# Altium schematic sheet DE-020224_01.SchDoc: CuC
size A3; Author: eldar6776@hotmail.com; DrawnBy: Eldar Dedic; Organization: I-MEDIA GROUP d.o.o.; Address1: Osman Topal Paše 18; Address2: 71000 Sarajevo; Address3: Federacija BiH; Address4: Bosna i Hercegovina; DocumentNumber: DE-200216; Revision: 278; SheetNumber: 1; SheetTotal: 2
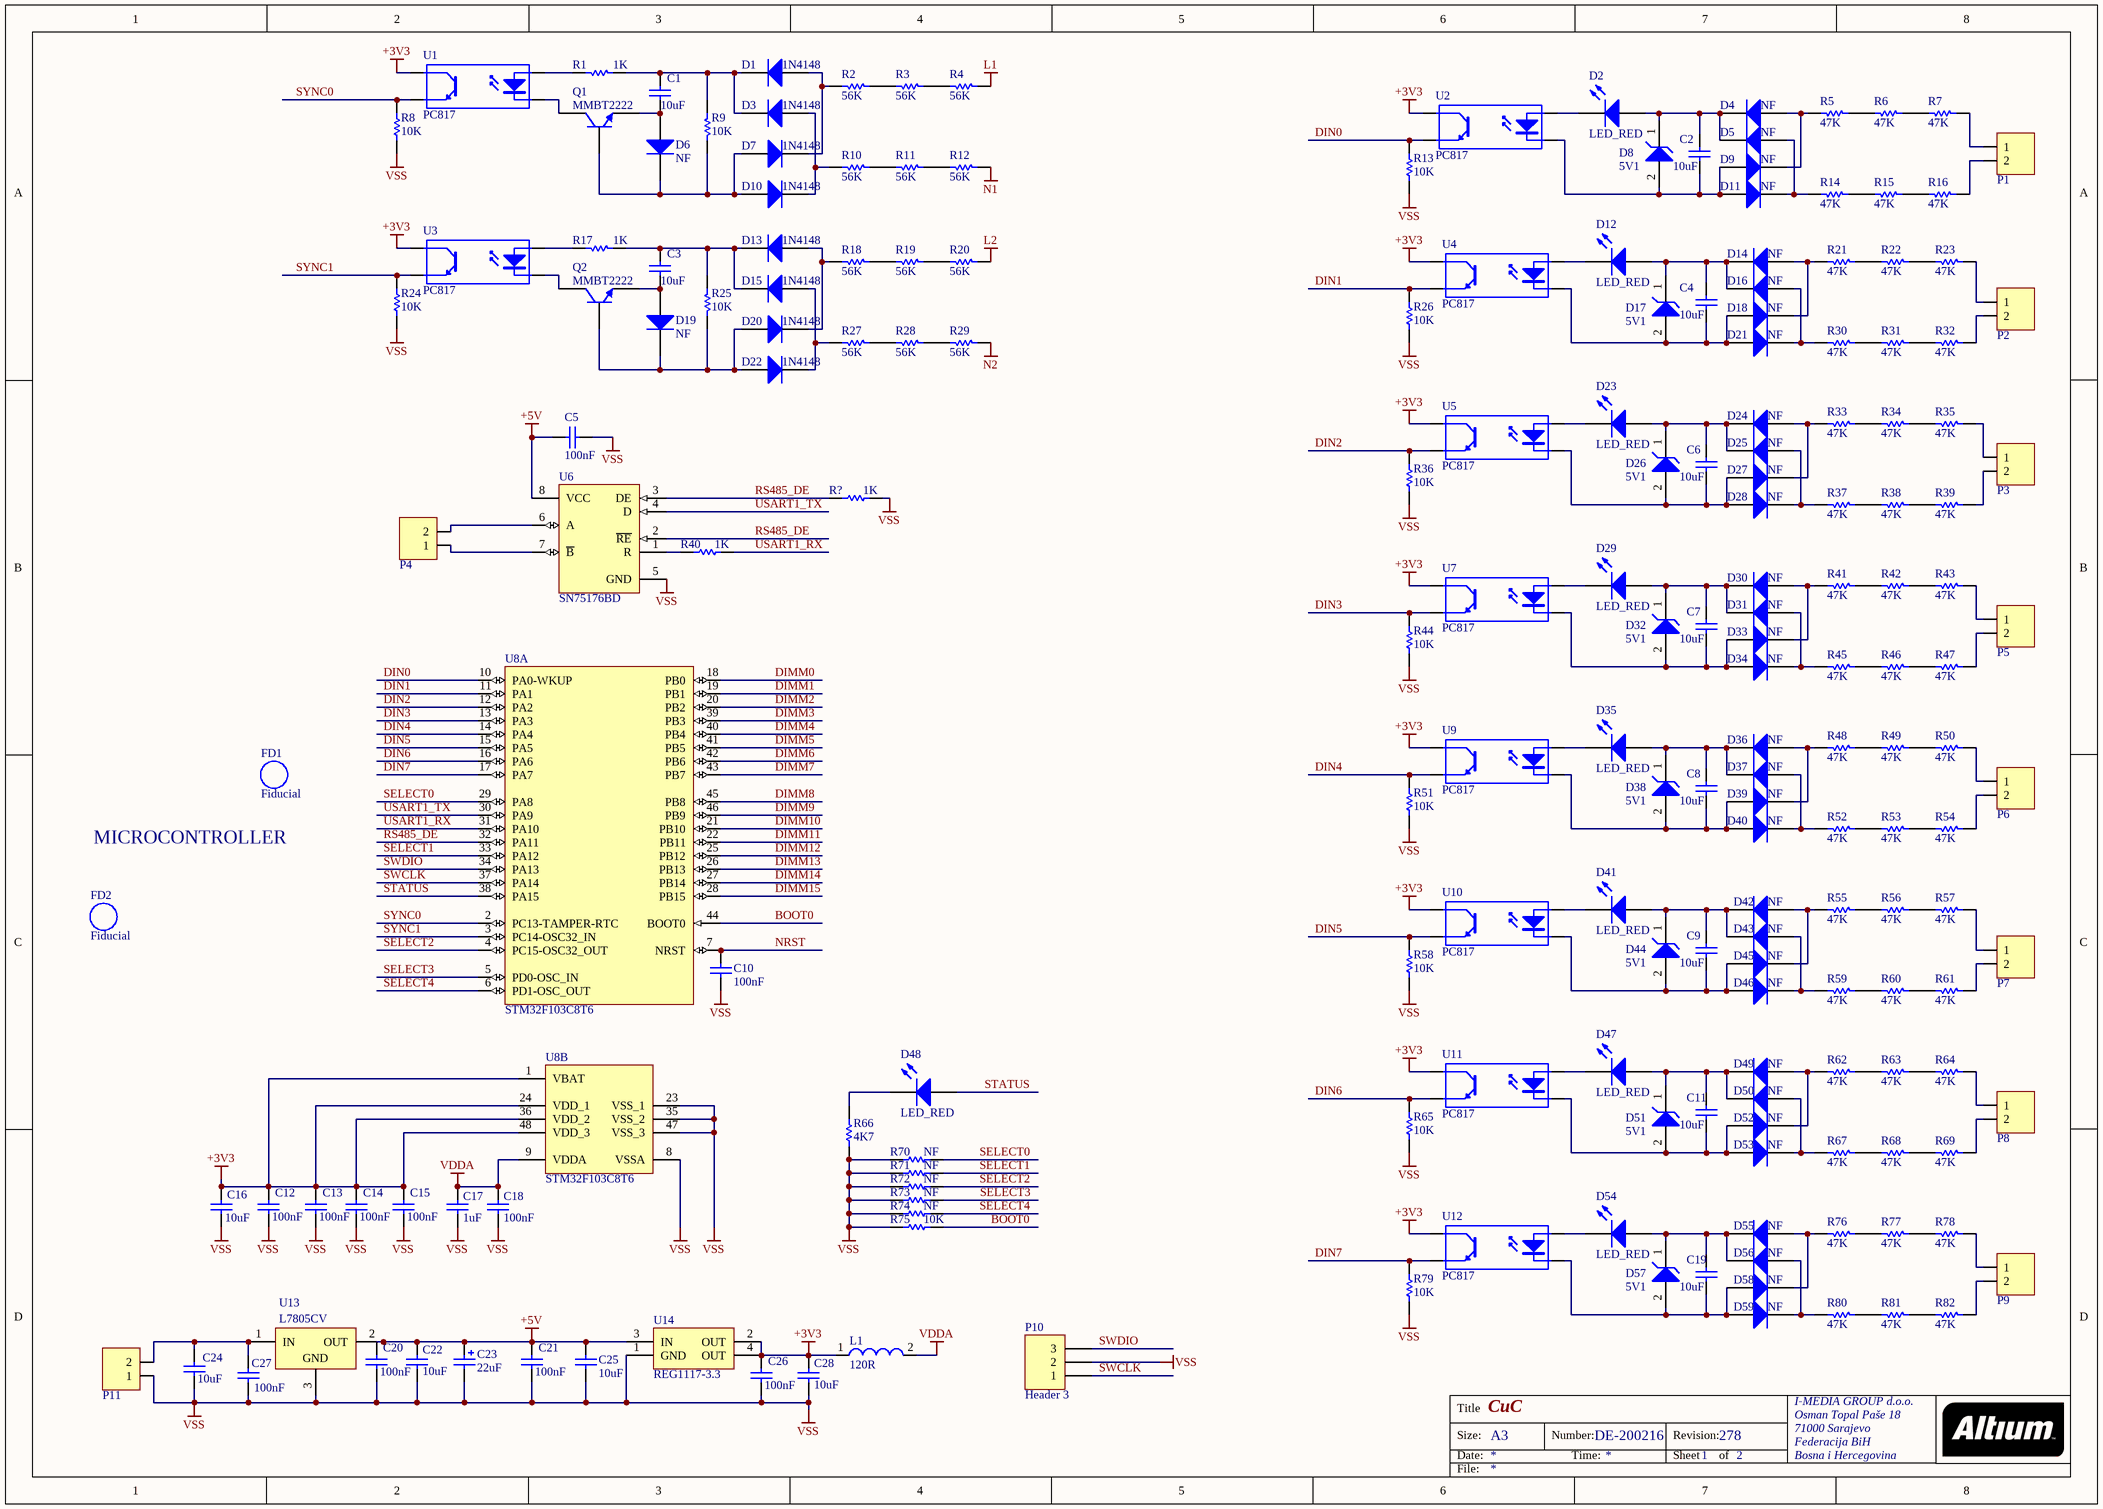
[diagram p0: DE-020224_01.SchDoc]

## Parts
C1  10uF  [0805]
C2  10uF  [0805]
C3  10uF  [0805]
C4  10uF  [0805]
C5  100nF  [0603]
C6  10uF  [0805]
C7  10uF  [0805]
C8  10uF  [0805]
C9  10uF  [0805]
C10  100nF  [0603]
C11  10uF  [0805]
C12  100nF  [0603]
C13  100nF  [0603]
C14  100nF  [0603]
C15  100nF  [0603]
C16  value 10uF  [0805]  (hidden comment: 4u7)
C17  1uF  [0603]
C18  100nF  [0603]
C19  10uF  [0805]
C20  100nF  [0603]
C21  100nF  [0603]
C22  10uF  [0805]
C23  22uF  [CAPPR2-5X11]
C24  10uF  [0805]
C25  10uF  [0805]
C26  100nF  [0603]
C27  100nF  [0603]
C28  10uF  [0805]
D1  1N4148  [SOD323]
D2  LED_RED  [1.6X0.8X0.8]
D3  1N4148  [SOD323]
D4  NF  [SOD323]
D5  NF  [SOD323]
D6  NF  [SOD323]
D7  1N4148  [SOD323]
D8  5V1  [ONSC-SOD-123-2-425-04_V]
D9  NF  [SOD323]
D10  1N4148  [SOD323]
D11  NF  [SOD323]
D12  LED_RED  [1.6X0.8X0.8]
D13  1N4148  [SOD323]
D14  NF  [SOD323]
D15  1N4148  [SOD323]
D16  NF  [SOD323]
D17  5V1  [ONSC-SOD-123-2-425-04_V]
D18  NF  [SOD323]
D19  NF  [SOD323]
D20  1N4148  [SOD323]
D21  NF  [SOD323]
D22  1N4148  [SOD323]
D23  LED_RED  [1.6X0.8X0.8]
D24  NF  [SOD323]
D25  NF  [SOD323]
D26  5V1  [ONSC-SOD-123-2-425-04_V]
D27  NF  [SOD323]
D28  NF  [SOD323]
D29  LED_RED  [1.6X0.8X0.8]
D30  NF  [SOD323]
D31  NF  [SOD323]
D32  5V1  [ONSC-SOD-123-2-425-04_V]
D33  NF  [SOD323]
D34  NF  [SOD323]
D35  LED_RED  [1.6X0.8X0.8]
D36  NF  [SOD323]
D37  NF  [SOD323]
D38  5V1  [ONSC-SOD-123-2-425-04_V]
D39  NF  [SOD323]
D40  NF  [SOD323]
D41  LED_RED  [1.6X0.8X0.8]
D42  NF  [SOD323]
D43  NF  [SOD323]
D44  5V1  [ONSC-SOD-123-2-425-04_V]
D45  NF  [SOD323]
D46  NF  [SOD323]
D47  LED_RED  [1.6X0.8X0.8]
D48  LED_RED  [1.6X0.8X0.8]
D49  NF  [SOD323]
D50  NF  [SOD323]
D51  5V1  [ONSC-SOD-123-2-425-04_V]
D52  NF  [SOD323]
D53  NF  [SOD323]
D54  LED_RED  [1.6X0.8X0.8]
D55  NF  [SOD323]
D56  NF  [SOD323]
D57  5V1  [ONSC-SOD-123-2-425-04_V]
D58  NF  [SOD323]
D59  NF  [SOD323]
FD1  Fiducial  [Fiducial]  (no BOM)
FD2  Fiducial  [Fiducial]  (no BOM)
L1  120R  [SMD-0805]
P1  TERMINAL BLOK 2  [TERMINAL BLOK 2]  (value not drawn)
P2  TERMINAL BLOK 2  [TERMINAL BLOK 2]  (value not drawn)
P3  TERMINAL BLOK 2  [TERMINAL BLOK 2]  (value not drawn)
P4  TERMINAL BLOK 2  [TERMINAL BLOK 2]  (value not drawn)
P5  TERMINAL BLOK 2  [TERMINAL BLOK 2]  (value not drawn)
P6  TERMINAL BLOK 2  [TERMINAL BLOK 2]  (value not drawn)
P7  TERMINAL BLOK 2  [TERMINAL BLOK 2]  (value not drawn)
P8  TERMINAL BLOK 2  [TERMINAL BLOK 2]  (value not drawn)
P9  TERMINAL BLOK 2  [TERMINAL BLOK 2]  (value not drawn)
P10  Header 3  [HDR1X3]
P11  TERMINAL BLOK 2  [TERMINAL BLOK 2]  (value not drawn)
Q1  MMBT2222  [SOT23_N]
Q2  MMBT2222  [SOT23_N]
R1  1K  [ERA-0805]
R2  56K  [ERA-0805]
R3  56K  [ERA-0805]
R4  56K  [ERA-0805]
R5  47K  [ERA-0805]
R6  47K  [ERA-0805]
R7  47K  [ERA-0805]
R8  10K  [ERA-0603]
R9  10K  [ERA-0805]
R10  56K  [ERA-0805]
R11  56K  [ERA-0805]
R12  56K  [ERA-0805]
R13  10K  [ERA-0603]
R14  47K  [ERA-0805]
R15  47K  [ERA-0805]
R16  47K  [ERA-0805]
R17  1K  [ERA-0805]
R18  56K  [ERA-0805]
R19  56K  [ERA-0805]
R20  56K  [ERA-0805]
R21  47K  [ERA-0805]
R22  47K  [ERA-0805]
R23  47K  [ERA-0805]
R24  10K  [ERA-0603]
R25  10K  [ERA-0805]
R26  10K  [ERA-0603]
R27  56K  [ERA-0805]
R28  56K  [ERA-0805]
R29  56K  [ERA-0805]
R30  47K  [ERA-0805]
R31  47K  [ERA-0805]
R32  47K  [ERA-0805]
R33  47K  [ERA-0805]
R34  47K  [ERA-0805]
R35  47K  [ERA-0805]
R36  10K  [ERA-0603]
R37  47K  [ERA-0805]
R38  47K  [ERA-0805]
R39  47K  [ERA-0805]
R40  1K  [ERA-0603]
R41  47K  [ERA-0805]
R42  47K  [ERA-0805]
R43  47K  [ERA-0805]
R44  10K  [ERA-0603]
R45  47K  [ERA-0805]
R46  47K  [ERA-0805]
R47  47K  [ERA-0805]
R48  47K  [ERA-0805]
R49  47K  [ERA-0805]
R50  47K  [ERA-0805]
R51  10K  [ERA-0603]
R52  47K  [ERA-0805]
R53  47K  [ERA-0805]
R54  47K  [ERA-0805]
R55  47K  [ERA-0805]
R56  47K  [ERA-0805]
R57  47K  [ERA-0805]
R58  10K  [ERA-0603]
R59  47K  [ERA-0805]
R60  47K  [ERA-0805]
R61  47K  [ERA-0805]
R62  47K  [ERA-0805]
R63  47K  [ERA-0805]
R64  47K  [ERA-0805]
R65  10K  [ERA-0603]
R66  4K7  [ERA-0603]
R67  47K  [ERA-0805]
R68  47K  [ERA-0805]
R69  47K  [ERA-0805]
R70  NF  [ERA-0603]
R71  NF  [ERA-0603]
R72  NF  [ERA-0603]
R73  NF  [ERA-0603]
R74  NF  [ERA-0603]
R75  10K  [ERA-0603]
R76  47K  [ERA-0805]
R77  47K  [ERA-0805]
R78  47K  [ERA-0805]
R79  10K  [ERA-0603]
R80  47K  [ERA-0805]
R81  47K  [ERA-0805]
R82  47K  [ERA-0805]
R?  1K  [ERA-0603]
U1  PC817  [DIP-4]
U2  PC817  [DIP-4]
U3  PC817  [DIP-4]
U4  PC817  [DIP-4]
U5  PC817  [DIP-4]
U6  SN75176BD  [D008_L]
U7  PC817  [DIP-4]
U8  STM32F103C8T6  [STM-LQFP48_N]  (parts A,B of 2)
U9  PC817  [DIP-4]
U10  PC817  [DIP-4]
U11  PC817  [DIP-4]
U12  PC817  [DIP-4]
U13  L7805CV  [TO220ABN]
U14  REG1117-3.3  [ZZ311]

## Nets
+3V3: C12.2 C13.2 C14.2 C15.2 C16.2 C26.2 C28.2 L1.1 U1.4(C) U2.4(C) U3.4(C) U4.4(C) U5.4(C) U7.4(C) U8.1(VBAT) U8.24(VDD_1) U8.36(VDD_2) U8.48(VDD_3) U9.4(C) U10.4(C) U11.4(C) U12.4(C) U14.2(OUT) U14.4(OUT)
+5V: C5.1 C20.2 C21.2 C22.2 C23.1 C25.2 U6.8(VCC) U13.2(OUT) U14.3(IN)
L1: R4.1
L2: R20.1
N1: R12.1
N2: R29.1
VDDA: C17.2 C18.2 L1.2 U8.9(VDDA)
VSS: C5.2 C10.1 C12.1 C13.1 C14.1 C15.1 C16.1 C17.1 C18.1 C20.1 C21.1 C22.1 C23.2 C24.1 C25.1 C26.1 C27.1 C28.1 P10.2 P11.1 R8.2 R13.2 R24.2 R26.2 R36.2 R44.2 R51.2 R58.2 R65.2 R66.2 R70.2 R71.2 R72.2 R73.2 R74.2 R75.2 R79.2 R?.2 U6.5(GND) U8.8(VSSA) U8.23(VSS_1) U8.35(VSS_2) U8.47(VSS_3) U13.3(GND) U14.1(GND)
BOOT0: R75.1 U8.44(BOOT0)
DIMM0: U8.18(PB0)
DIMM1: U8.19(PB1)
DIMM2: U8.20(PB2)
DIMM3: U8.39(PB3)
DIMM4: U8.40(PB4)
DIMM5: U8.41(PB5)
DIMM6: U8.42(PB6)
DIMM7: U8.43(PB7)
DIMM8: U8.45(PB8)
DIMM9: U8.46(PB9)
DIMM10: U8.21(PB10)
DIMM11: U8.22(PB11)
DIMM12: U8.25(PB12)
DIMM13: U8.26(PB13)
DIMM14: U8.27(PB14)
DIMM15: U8.28(PB15)
DIN0: R13.1 U2.3(E) U8.10(PA0-WKUP)
DIN1: R26.1 U4.3(E) U8.11(PA1)
DIN2: R36.1 U5.3(E) U8.12(PA2)
DIN3: R44.1 U7.3(E) U8.13(PA3)
DIN4: R51.1 U8.14(PA4) U9.3(E)
DIN5: R58.1 U8.15(PA5) U10.3(E)
DIN6: R65.1 U8.16(PA6) U11.3(E)
DIN7: R79.1 U8.17(PA7) U12.3(E)
NRST: C10.2 U8.7(NRST)
RS485_DE: R?.1 U6.2(~{RE}) U6.3(DE) U8.32(PA11)
SELECT0: R70.1 U8.29(PA8)
SELECT1: R71.1 U8.33(PA12)
SELECT2: R72.1 U8.4(PC15-OSC32_OUT)
SELECT3: R73.1 U8.5(PD0-OSC_IN)
SELECT4: R74.1 U8.6(PD1-OSC_OUT)
STATUS: D48.1(A) U8.38(PA15)
SWCLK: P10.1 U8.37(PA14)
SWDIO: P10.3 U8.34(PA13)
SYNC0: R8.1 U1.3(E) U8.2(PC13-TAMPER-RTC)
SYNC1: R24.1 U3.3(E) U8.3(PC14-OSC32_IN)
USART1_RX: R40.2 U8.31(PA10)
USART1_TX: U6.4(D) U8.30(PA9)
NetC1_1: C1.1 D6.2(A) Q1.2(E)
NetC1_2: C1.2 D1.1(K) D3.1(K) R1.2 R9.1
NetC2_1: C2.1 D8.2(A) D9.2(A) D11.2(A) U2.2(K)
NetC2_2: C2.2 D2.1(A) D4.1(K) D5.1(K) D8.1(K)
NetC3_1: C3.1 D19.2(A) Q2.2(E)
NetC3_2: C3.2 D13.1(K) D15.1(K) R17.2 R25.1
NetC4_1: C4.1 D17.2(A) D18.2(A) D21.2(A) U4.2(K)
NetC4_2: C4.2 D12.1(A) D14.1(K) D16.1(K) D17.1(K)
NetC6_1: C6.1 D26.2(A) D27.2(A) D28.2(A) U5.2(K)
NetC6_2: C6.2 D23.1(A) D24.1(K) D25.1(K) D26.1(K)
NetC7_1: C7.1 D32.2(A) D33.2(A) D34.2(A) U7.2(K)
NetC7_2: C7.2 D29.1(A) D30.1(K) D31.1(K) D32.1(K)
NetC8_1: C8.1 D38.2(A) D39.2(A) D40.2(A) U9.2(K)
NetC8_2: C8.2 D35.1(A) D36.1(K) D37.1(K) D38.1(K)
NetC9_1: C9.1 D44.2(A) D45.2(A) D46.2(A) U10.2(K)
NetC9_2: C9.2 D41.1(A) D42.1(K) D43.1(K) D44.1(K)
NetC11_1: C11.1 D51.2(A) D52.2(A) D53.2(A) U11.2(K)
NetC11_2: C11.2 D47.1(A) D49.1(K) D50.1(K) D51.1(K)
NetC19_1: C19.1 D57.2(A) D58.2(A) D59.2(A) U12.2(K)
NetC19_2: C19.2 D54.1(A) D55.1(K) D56.1(K) D57.1(K)
NetC24_2: C24.2 C27.2 P11.2 U13.1(IN)
NetD1_2: D1.2(A) D7.1(K) R2.2
NetD2_2: D2.2(K) U2.1(A)
NetD3_2: D3.2(A) D10.1(K) R10.2
NetD4_2: D4.2(A) D9.1(K) R5.2
NetD5_2: D5.2(A) D11.1(K) R14.2
NetD6_1: D6.1(K) D7.2(A) D10.2(A) Q1.1(B) R9.2
NetD12_2: D12.2(K) U4.1(A)
NetD13_2: D13.2(A) D20.1(K) R18.2
NetD14_2: D14.2(A) D18.1(K) R21.2
NetD15_2: D15.2(A) D22.1(K) R27.2
NetD16_2: D16.2(A) D21.1(K) R30.2
NetD19_1: D19.1(K) D20.2(A) D22.2(A) Q2.1(B) R25.2
NetD23_2: D23.2(K) U5.1(A)
NetD24_2: D24.2(A) D27.1(K) R33.2
NetD25_2: D25.2(A) D28.1(K) R37.2
NetD29_2: D29.2(K) U7.1(A)
NetD30_2: D30.2(A) D33.1(K) R41.2
NetD31_2: D31.2(A) D34.1(K) R45.2
NetD35_2: D35.2(K) U9.1(A)
NetD36_2: D36.2(A) D39.1(K) R48.2
NetD37_2: D37.2(A) D40.1(K) R52.2
NetD41_2: D41.2(K) U10.1(A)
NetD42_2: D42.2(A) D45.1(K) R55.2
NetD43_2: D43.2(A) D46.1(K) R59.2
NetD47_2: D47.2(K) U11.1(A)
NetD48_2: D48.2(K) R66.1
NetD49_2: D49.2(A) D52.1(K) R62.2
NetD50_2: D50.2(A) D53.1(K) R67.2
NetD54_2: D54.2(K) U12.1(A)
NetD55_2: D55.2(A) D58.1(K) R76.2
NetD56_2: D56.2(A) D59.1(K) R80.2
NetP1_1: P1.1 R7.1
NetP1_2: P1.2 R16.1
NetP2_1: P2.1 R23.1
NetP2_2: P2.2 R32.1
NetP3_1: P3.1 R35.1
NetP3_2: P3.2 R39.1
NetP4_1: P4.1 U6.7(~{B})
NetP4_2: P4.2 U6.6(A)
NetP5_1: P5.1 R43.1
NetP5_2: P5.2 R47.1
NetP6_1: P6.1 R50.1
NetP6_2: P6.2 R54.1
NetP7_1: P7.1 R57.1
NetP7_2: P7.2 R61.1
NetP8_1: P8.1 R64.1
NetP8_2: P8.2 R69.1
NetP9_1: P9.1 R78.1
NetP9_2: P9.2 R82.1
NetQ1_3: Q1.3(C) U1.2(K)
NetQ2_3: Q2.3(C) U3.2(K)
NetR1_1: R1.1 U1.1(A)
NetR2_1: R2.1 R3.2
NetR3_1: R3.1 R4.2
NetR5_1: R5.1 R6.2
NetR6_1: R6.1 R7.2
NetR10_1: R10.1 R11.2
NetR11_1: R11.1 R12.2
NetR14_1: R14.1 R15.2
NetR15_1: R15.1 R16.2
NetR17_1: R17.1 U3.1(A)
NetR18_1: R18.1 R19.2
NetR19_1: R19.1 R20.2
NetR21_1: R21.1 R22.2
NetR22_1: R22.1 R23.2
NetR27_1: R27.1 R28.2
NetR28_1: R28.1 R29.2
NetR30_1: R30.1 R31.2
NetR31_1: R31.1 R32.2
NetR33_1: R33.1 R34.2
NetR34_1: R34.1 R35.2
NetR37_1: R37.1 R38.2
NetR38_1: R38.1 R39.2
NetR40_1: R40.1 U6.1(R)
NetR41_1: R41.1 R42.2
NetR42_1: R42.1 R43.2
NetR45_1: R45.1 R46.2
NetR46_1: R46.1 R47.2
NetR48_1: R48.1 R49.2
NetR49_1: R49.1 R50.2
NetR52_1: R52.1 R53.2
NetR53_1: R53.1 R54.2
NetR55_1: R55.1 R56.2
NetR56_1: R56.1 R57.2
NetR59_1: R59.1 R60.2
NetR60_1: R60.1 R61.2
NetR62_1: R62.1 R63.2
NetR63_1: R63.1 R64.2
NetR67_1: R67.1 R68.2
NetR68_1: R68.1 R69.2
NetR76_1: R76.1 R77.2
NetR77_1: R77.1 R78.2
NetR80_1: R80.1 R81.2
NetR81_1: R81.1 R82.2

## Notes on the sheet
- MICROCONTROLLER
- Title
- Size:
- Date:
- A3
- Number:
- Time:
- Revision:
- Sheet
- of
- File:

## Library data of the parts
C1-C4 C6-C9 C11 C16 C19 C22 C24 C25 C28 = C0805: Ceramic Chip Capacitor - Standard; Note: Footprint corresponds to dimensions for bulk cassette packaging. This case size has tightened tolerances.; Published: 17-Jul-2002; LatestRevisionDate: 19-Mar-2004; LatestRevisionNote: Silkscreen size reduced.; DatasheetDocument: Mar-2001; PackageDocument: Mar-2001; PackageReference: 0805; Publisher: Altium Limited; Code_JEITA: 0805; Code_IPC: 2012[0805]; ComponentLink1Description: Manufacturer Link; ComponentLink1URL: http://www.kemet.com/; ComponentLink2Description: Datasheet; ComponentLink2URL: http://www.kemet.com/kemet/web/homepage/kechome.nsf/vapubfilesname/F3102TA.pdf/$file/F3102TA.pdf
C5 C10 C12-C15 C17 C18 C20 C21 C26 C27 = C0603: Ceramic Chip Capacitor - Standard; Note: Footprint corresponds to dimensions for bulk cassette packaging. This case size has tightened tolerances.; Published: 17-Jul-2002; LatestRevisionDate: 19-Mar-2004; LatestRevisionNote: Silkscreen size reduced.; DatasheetDocument: Mar-2001; PackageDocument: Mar-2001; PackageReference: 0603; Publisher: Altium Limited; Code_JEITA: 0603; Code_IPC: 1608 [0603]; ComponentLink1Description: Manufacturer Link; ComponentLink1URL: http://www.kemet.com/; ComponentLink2Description: Datasheet; ComponentLink2URL: http://www.kemet.com/kemet/web/homepage/kechome.nsf/vapubfilesname/F3102TA.pdf/$file/F3102TA.pdf
  C10 C18 C27: Value: 100nF
  C17: Value: 1uF
C23 = EKA00AA247F00: Aluminum Electrolytic Capacitor, Radial Style with Long Leads: 47uF, 35V; Note: Refer to Manufacturer's Data Sheets for other lead formations; DrillSize: Nominal, Rounded To The Nearest 0.1mm; Published: 19-Mar-2004; DatasheetDocument: 20-Feb-2001; PackageReference: CAPPR2-5X11; Publisher: Altium Limited; ComponentLink1Description: Manufacturer Link; ComponentLink1URL: http://www.vishay.com/; ComponentLink2Description: Datasheet; ComponentLink2URL: http://www.vishay.com/docs/25014/eka.pdf; Value: 47uF
D1 D3-D7 D9-D11 D13-D16 D18-D22 D24 D25 D27 D28 D30 D31 D33 D34 D36 D37 D39 D40 D42 D43 D45 D46 D49 D50 D52 D53 D55 D56 D58 D59 = BAS321: General-purpose Diode; Published: 17-Sep-2003; LatestRevisionDate: 19-Mar-2004; LatestRevisionNote: Silkscreen size reduced.; DatasheetVersion: 9-Feb-1999; PackageVersion: May-1999; PackageReference: SOD323; Publisher: Altium Limited; PackageDescription: SOD-323/SC-76; 2 Leads; Body 1.7 x 1.3 mm, (LxW); ComponentLink1Description: Manufacturer Link; ComponentLink1URL: http://www.semiconductors.philips.com/; ComponentLink2Description: Datasheet; ComponentLink2URL: http://www.semiconductors.philips.com/acrobat/datasheets/BAS321_2.pdf
D2 D12 D23 D29 D35 D41 D47 D48 D54 = HSMZ-C190: High Performance Chip LED, Red; LuminousIntensity: 40mcd (Minimum).; PCB_Layout: Complies with manufacturer's recommendation.; Published: 11-Dec-2002; DatasheetDocument: 11-Mar-2002; PackageDocument: 11-Mar-2002; PackageReference: 1.6X0.8X0.8; Publisher: Altium Limited; LED_Colour: Red; ComponentLink1Description: Manufacturer Link; ComponentLink1URL: http://www.agilent.com/; ComponentLink2Description: Datasheet; ComponentLink2URL: http://cp.literature.agilent.com/litweb/pdf/5988-5891EN.pdf
D8 D17 D26 D32 D38 D44 D51 D57 = MMSZ5V1T1: Zener Voltage Regulator, 500 mW, 2-Pin SOD-123, Tape and Reel; Manufacturer: On Semiconductor; P Max (W): 0.5; DatasheetVersion: Rev. 11; PackageVersion: Rev. G, 10/2009; PackageReference: SOD-123-2-425-04; PackageDescription: 2-Pin SOD, Body 1.6 x 2.69 mm; Supplier 1: Digi-Key; Supplier Part Number 1: MMSZ5V1T1OSCT-ND; Supplier 2: Mouser; Supplier Part Number 2: 863-MMSZ5V1T1; Packing: Tape and Reel; Mounting Technology: Surface Mount; PartNumber: MMSZ5V1T1; ComponentLink1Description: Manufacturer URL; ComponentLink1URL: http://www.onsemi.com/; ComponentLink2Description: Datasheet; ComponentLink2URL: http://www.onsemi.com/pub_link/Collateral/MMSZ2V4T1-D.PDF; ComponentLink3Description: Package Specification; ComponentLink3URL: http://www.onsemi.com/pub_link/Collateral/425-04.PDF
FD1 FD2 = Fiduchial: Fiduchial mark
L1 = 74279202: SMD EMI Suppression Ferrite Bead WE-CBF, Z = 120 Ohm; Impedance: 120 Ohm; DatasheetVersion: Dec-2005; PackageVersion: 2005; PackageReference: SMD-0805; PackageDescription: Chip Inductor, 2-Leads, Body 2.0 x 1.2 mm; ComponentLink1Description: Manufacturer URL; ComponentLink1URL: http://www.we-online.com; ComponentLink2Description: Datasheet; ComponentLink2URL: http://www.we-online.de/katalog/media/pdf/74279202.pdf
P1-P9 P11 = TERMINAL BLOK 2: 2 pinski terminal blok
P10 = Header 3: Header, 3-Pin; LatestRevisionDate: 17-Jul-2002; LatestRevisionNote: Re-released for DXP Platform.; Publisher: Altium Limited
Q1 Q2 = BC817: NPN General-purpose Transistor; Published: 17-Sep-2003; LatestRevisionDate: 12-Dec-2006; LatestRevisionNote: IPC-7351 Footprint Added.; DatasheetVersion: Jun-1999; PackageVersion: May-1999; PackageReference: SOT23; Publisher: Altium Limited; PackageDescription: 3-Pin SOT-23 Package 0.95 mm Pitch, 2.3 mm Lead Span; ComponentLink1Description: Manufacturer Link; ComponentLink1URL: http://www.semiconductors.philips.com/; ComponentLink2Description: Datasheet; ComponentLink2URL: http://www.semiconductors.philips.com/acrobat/datasheets/BC817_BC817W_BC337_5.pdf
R1-R7 R9-R12 R14-R23 R25 R27-R35 R37-R39 R41-R43 R45-R50 R52-R57 R59-R64 R67-R69 R76-R78 R80-R82 = ERA6Y: Rectangular Thick Film Chip Resistor, 10 Ohm to 1M Ohm Range, 0.1% and 0.5% Tolerance, 0805 Size, 0.1 W; Note: If flow soldering, adjust pad width of PCB Footprint to 0.7 - 0.8 times the width of the resistor.; Published: 17-Dec-2003; LatestRevisionDate: 19-Mar-2004; LatestRevisionNote: Silkscreen size reduced.; PackageDocument: Mar-2003; PackageReference: ERA-0805; Publisher: Altium Limited; Code_IPC: 2012 [0805]; ComponentLink1Description: Manufacturer Link; ComponentLink1URL: http://www.panasonic.com/industrial/components/resistive_products.htm; ComponentLink2Description: Datasheet; ComponentLink2URL: http://www.panasonic.com/industrial/components/pdf/AOA0000CE8.pdf
R8 R13 R24 R26 R36 R40 R44 R51 R58 R65 R66 R70-R75 R79 R? = ERAV: Metal Film Thermosensitive Chip Resistor, 0.56 Ohm to 10k Ohm Range, 5% Tolerance, 0603 Size, 0.063 W; Note: If flow soldering, adjust pad width of PCB Footprint to 0.7 - 0.8 times the width of the resistor.; Published: 17-Dec-2003; LatestRevisionDate: 19-Mar-2004; LatestRevisionNote: Silkscreen size reduced.; PackageDocument: Mar-2003; PackageReference: ERA-0603; Publisher: Altium Limited; Code_IPC: 1608 [0603]; ComponentLink1Description: Manufacturer Link; ComponentLink1URL: http://www.panasonic.com/industrial/components/resistive_products.htm; ComponentLink2Description: Datasheet; ComponentLink2URL: http://www.panasonic.com/industrial/components/pdf/AOF0000CE1.pdf
U1-U5 U7 U9-U12 = PC817: 4-Pin Phototransistor Optocoupler; Published: 24-Mar-1999; LatestRevisionDate: 04-Mar-2005; LatestRevisionNote: Sch pins 3 & 4 Swapped.; DatasheetVersion: Nov-2003; PackageReference: DIP-4; Publisher: Altium Limited
U6 = SN75176BD: Differential Bus Transceiver; Note: Receiver Hysteresis of 50mV Typical; Published: 15-May-2002; LatestRevisionDate: 13-Apr-2006; LatestRevisionNote: IPC-7351 Footprint Added.; DatasheetVersion: Sep-1989; PackageVersion: Jan-1998; PackageReference: D008; Publisher: Altium Limited; PackageDescription: 8-Pin Small Outline Integrated Circuit 1.27 mm Pitch; Code_IPC: SOIC127P600-8; ComponentLink1Description: Manufacturer Link; ComponentLink1URL: http://www.ti.com/; ComponentLink2Description: Datasheet; ComponentLink2URL: http://www-s.ti.com/sc/ds/sn75176b.pdf
U8 = STM32F103C8T6: ARM Cortex-M3 32-bit MCU, 64 KB Flash, 20 KB Internal RAM, 37 I/Os, 48-pin LQFP, -40 to 85 degC, Tray; A/D Converter: 2x12-bit (10 Channel); FLASH Size (Prog) (kB): 64; I/Os (High Current): 37; Internal RAM Size (kB): 20; Operating Frequency(F) (Processor speed) (MHz): 72; Supply Voltage(Vcc) min (V): 2; DatasheetVersion: Rev. 16; PackageVersion: Rev. 6, 06/2013; PackageReference: LQFP48; PackageDescription: 48-Pin Low Profile Quad Flat Package, 7 x 7 mm Body, 0.5 mm Pitch; Supplier 1: Digi-Key; Supplier Part Number 1: 497-6063-ND; Supplier 2: Farnell; Supplier Part Number 2: 1447637; Supplier 3: Newark; Supplier Part Number 3: 59M2182; Supplier 4: Newark; Supplier Part Number 4: 57P1222; Supplier 5: Mouser; Supplier Part Number 5: 511-STM32F103C8T6; Core: ARM Cortex-M3; Packing: Tray; Mounting Technology: Surface Mount; PartNumber: STM32F103C8T6; ComponentLink1Description: Manufacturer URL; ComponentLink1URL: http://www.st.com/web/en/home.html; ComponentLink2Description: Datasheet; ComponentLink2URL: http://www.st.com/st-web-ui/static/active/en/resource/technical/document/datasheet/CD00161566.pdf; ComponentLink3Description: Package Specification; ComponentLink3URL: http://www.st.com/st-web-ui/static/active/en/resource/technical/document/datasheet/DM00058181.pdf
U13 = L7805CV: Positive Voltage Regulator; Note: Tab is connected to pin 3 (GND).; Published: 24-Aug-2001; LatestRevisionDate: 17-Jul-2002; LatestRevisionNote: Re-released for DXP Platform.; DatasheetVersion: Dec-1998; PackageVersion: Jun-1998; PackageReference: TO220ABN; Publisher: Altium Limited; PackageDescription: TO, Thru-Hole, Vertical, Heatsink Mounted; 3 In-Line Leads; Pitch 2.54 mm; Pin sequence 1, 3, 2; ComponentLink1Description: Manufacturer Link; ComponentLink1URL: http://www.st.com/
U14 = REG1117-3.3: 800mA and 1A Low Dropout Positive Regulator 2.85V, 3.3V, 5V, and Adjustable; Published: 8-Jun-2000; LatestRevisionDate: 17-Jul-2002; LatestRevisionNote: Re-released for DXP Platform.; DatasheetVersion: Sep-1997; PackageVersion: revC; PackageReference: ZZ311; Publisher: Altium Limited; PackageDescription: SOT-223/SC-73; 4 Leads; Body 6.7 x 7.3 mm, inc. leads (LxW max); ComponentLink1Description: Manufacturer Link; ComponentLink1URL: http://www.ti.com/; ComponentLink2Description: Datasheet; ComponentLink2URL: http://www-s.ti.com/sc/ds/REG1117.pdf